# Altium schematic sheet carteAsserv.SchDoc
size A4
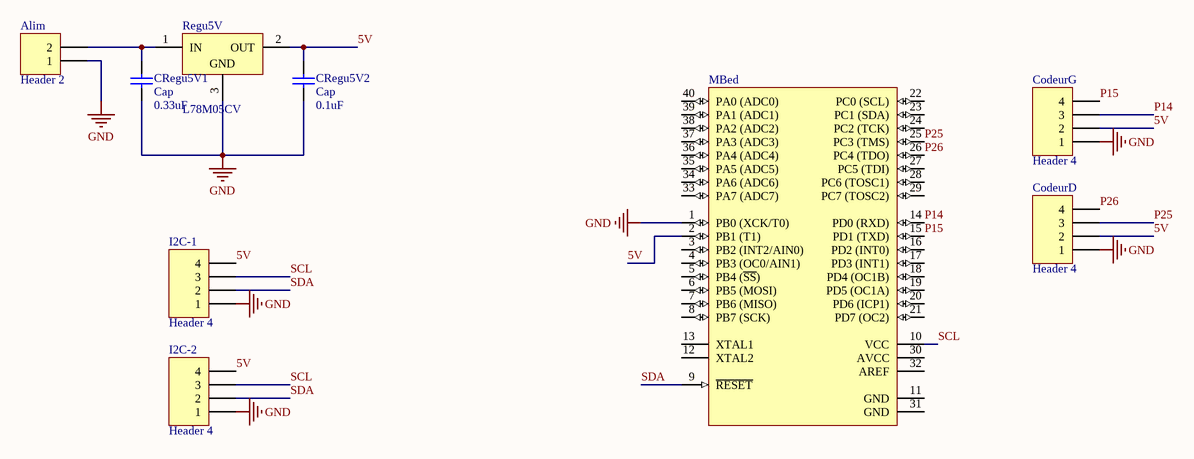
[diagram p0: carteAsserv.SchDoc]

## Parts
Alim  Header 2  [HDR1X2]
CodeurD  Header 4  [HDR1X4]
CodeurG  Header 4  [HDR1X4]
CRegu5V1  Cap  value 0.33uF  [C0805]
CRegu5V2  Cap  value 0.1uF  [C0805]
I2C-1  Header 4  [HDR1X4]
I2C-2  Header 4  [HDR1X4]
MBed  ATmega162V-8PU  [MBed]  (value not drawn)
Regu5V  L78M05CV  [TO220V]

## Nets
GND: Alim.1 CodeurD.1 CodeurG.1 CRegu5V1.1 CRegu5V2.1 I2C-1.1 I2C-2.1 MBed.1(PB0_(XCK/T0)) Regu5V.3(GND)
5V: CodeurD.2 CodeurG.2 CRegu5V2.2 I2C-1.4 I2C-2.4 MBed.2(PB1_(T1)) Regu5V.2(OUT)
P14: CodeurG.3 MBed.14(PD0_(RXD))
P15: CodeurG.4 MBed.15(PD1_(TXD))
P25: CodeurD.3 MBed.25(PC3_(TMS))
P26: CodeurD.4 MBed.26(PC4_(TDO))
SCL: I2C-1.3 I2C-2.3 MBed.10(VCC)
SDA: I2C-1.2 I2C-2.2 MBed.9(~{RESET})
NetAlim_2: Alim.2 CRegu5V1.2 Regu5V.1(IN)

Not connected (* = marked no-connect by the designer): MBed 3(PB2_(INT2/AIN0)) 4(PB3_(OC0/AIN1)) 5(PB4_(~{SS})) 6(PB5_(MOSI)) 7(PB6_(MISO)) 8(PB7_(SCK)) 11(GND) 12(XTAL2) 13(XTAL1) 16(PD2_(INT0)) 17(PD3_(INT1)) 18(PD4_(OC1B)) 19(PD5_(OC1A)) 20(PD6_(ICP1)) 21(PD7_(OC2)) 22(PC0_(SCL)) 23(PC1_(SDA)) 24(PC2_(TCK)) 27(PC5_(TDI)) 28(PC6_(TOSC1)) 29(PC7_(TOSC2)) 30(AVCC) 31(GND) 32(AREF) 33(PA7_(ADC7)) 34(PA6_(ADC6)) 35(PA5_(ADC5)) 36(PA4_(ADC4)) 37(PA3_(ADC3)) 38(PA2_(ADC2)) 39(PA1_(ADC1)) 40(PA0_(ADC0))

## Library data of the parts
Alim = Header 2: Header, 2-Pin; LatestRevisionDate: 17-Jul-2002; LatestRevisionNote: Re-released for DXP Platform.; Publisher: Altium Limited
CodeurD CodeurG I2C-1 I2C-2 = Header 4: Header, 4-Pin; LatestRevisionDate: 17-Jul-2002; LatestRevisionNote: Re-released for DXP Platform.; Publisher: Altium Limited
CRegu5V1 CRegu5V2 = Cap: Capacitor; Published: 8-Jun-2000; LatestRevisionDate: 17-Jul-2002; LatestRevisionNote: Re-released for DXP Platform.; PackageReference: RAD-0.3; Publisher: Altium Limited; PackageDescription: Radial Cap, Thru-Hole; 2 Leads; 0.3 in Pin Spacing
MBed = ATmega162V-8PU: 8-bit AVR Microcontroller, 16KB Flash, 512 Bytes EEPROM, 1KB SRAM, 40-pin PDIP, Industrial Grade (-40°C to 85°C); Published: 1-Apr-2010; DatasheetVersion: revK, Jul-2009; PackageVersion: revB, Sep-2001; PackageReference: 40P6; Publisher: Altium Limited; PackageDescription: 40-lead (0.600"/15.24mm Wide) Plastic Dual Inline Package (PDIP); Supplier 1: Digi-Key; Supplier Part Number 1: ATMEGA162V-8PU-ND; Supplier 2: Farnell; Supplier Part Number 2: 9171185; Supplier 3: Mouser; Supplier Part Number 3: 556-ATMEGA162V8PU; Code_JEDEC: MS-011-AC; ComponentLink1Description: Manufacturer Link; ComponentLink1URL: http://www.atmel.com/products/avr/default.asp?; ComponentLink2Description: ATmega162 (V)  Datasheet; ComponentLink2URL: http://www.atmel.com/dyn/resources/prod_documents/doc2513.pdf; ComponentLink3Description: ATmega162 (V) Summary; ComponentLink3URL: http://www.atmel.com/dyn/resources/prod_documents/2513S.pdf; ComponentLink4Description: Atmel.com Home; ComponentLink4URL: http://www.atmel.com
Regu5V = L78M05CV: Positive Voltage Regulator; Note: Tab is connected to pin 3 (GND).; Published: 24-Aug-2001; LatestRevisionDate: 17-Jul-2002; LatestRevisionNote: Re-released for DXP Platform.; DatasheetVersion: Apr-1994; PackageReference: TO220V; Publisher: Altium Limited; PackageDescription: TO, Thru-Hole, Vertical, Heatsink Mounted; 3 In-Line Leads; Pitch 2.54 mm; Pin sequence 1, 3, 2; ComponentLink1Description: Manufacturer Link; ComponentLink1URL: http://www.st.com/; ComponentLink2Description: Datasheet; ComponentLink2URL: http://www.st.com/stonline/products/literature/ds/2146/l78m05c.pdf